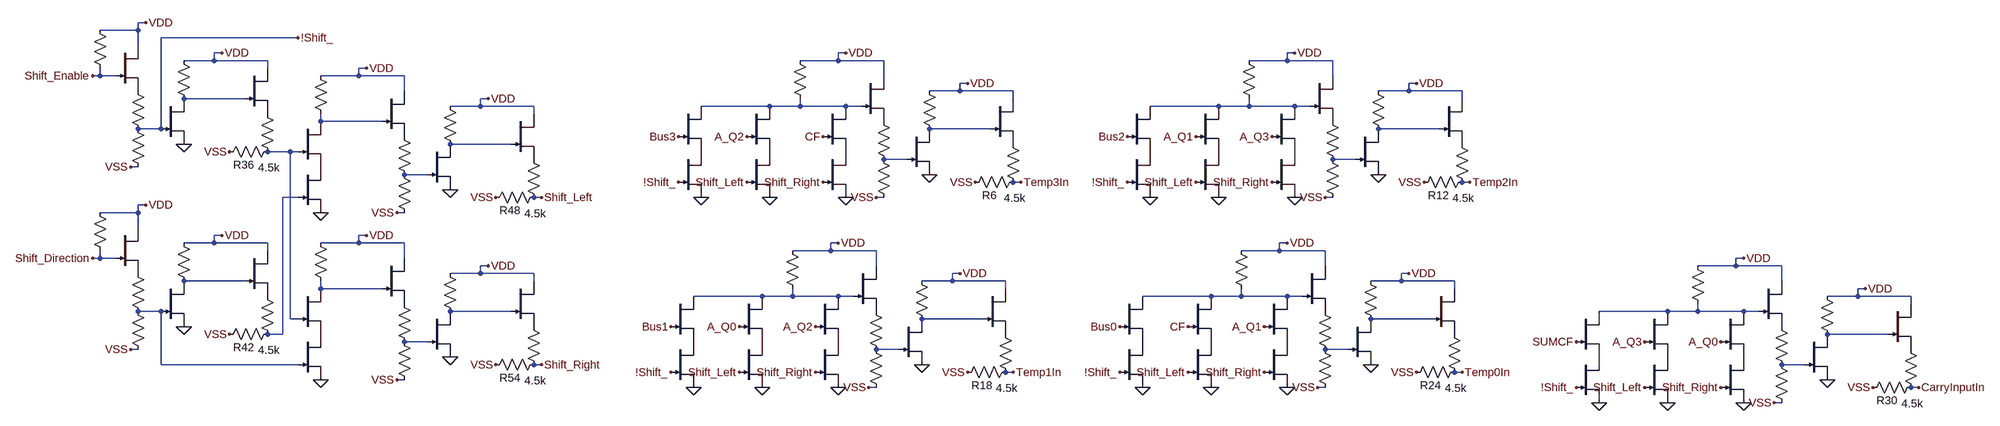
[diagram p0: schematic shift_logic.asc]
shift_logic.asc, the LTspice schematic file:
Version 4.1
SHEET 1 109444 42780
WIRE -5792 3776 -5808 3776
WIRE -5808 3792 -5808 3776
WIRE -5808 3792 -5888 3792
WIRE -5472 3808 -5760 3808
WIRE -5808 3824 -5808 3792
WIRE -5632 3840 -5648 3840
WIRE -4320 3840 -4336 3840
WIRE -3376 3840 -3392 3840
WIRE -5648 3856 -5648 3840
WIRE -5648 3856 -5712 3856
WIRE -5536 3856 -5648 3856
WIRE -4336 3856 -4336 3840
WIRE -4336 3856 -4416 3856
WIRE -4240 3856 -4336 3856
WIRE -3392 3856 -3392 3840
WIRE -3392 3856 -3472 3856
WIRE -3296 3856 -3392 3856
WIRE -5536 3872 -5536 3856
WIRE -5328 3872 -5344 3872
WIRE -5888 3888 -5888 3872
WIRE -5888 3888 -5904 3888
WIRE -5856 3888 -5888 3888
WIRE -5344 3888 -5344 3872
WIRE -5344 3888 -5424 3888
WIRE -5248 3888 -5344 3888
WIRE -4240 3888 -4240 3856
WIRE -3296 3888 -3296 3856
WIRE -4064 3904 -4080 3904
WIRE -3120 3904 -3136 3904
WIRE -5248 3920 -5248 3888
WIRE -4080 3920 -4080 3904
WIRE -4080 3920 -4144 3920
WIRE -3968 3920 -4080 3920
WIRE -3136 3920 -3136 3904
WIRE -3136 3920 -3200 3920
WIRE -3024 3920 -3136 3920
WIRE -5584 3936 -5712 3936
WIRE -5072 3936 -5088 3936
WIRE -3968 3936 -3968 3920
WIRE -3024 3936 -3024 3920
WIRE -5088 3952 -5088 3936
WIRE -5088 3952 -5152 3952
WIRE -4976 3952 -5088 3952
WIRE -4480 3952 -4624 3952
WIRE -4416 3952 -4416 3936
WIRE -4416 3952 -4480 3952
WIRE -4320 3952 -4416 3952
WIRE -4288 3952 -4320 3952
WIRE -3536 3952 -3680 3952
WIRE -3472 3952 -3472 3936
WIRE -3472 3952 -3536 3952
WIRE -3376 3952 -3472 3952
WIRE -3344 3952 -3376 3952
WIRE -4976 3968 -4976 3952
WIRE -5424 3984 -5424 3968
WIRE -5296 3984 -5424 3984
WIRE -5760 4000 -5760 3808
WIRE -5760 4000 -5808 4000
WIRE -4016 4000 -4144 4000
WIRE -3072 4000 -3200 4000
WIRE -5024 4032 -5152 4032
WIRE -5488 4048 -5536 4048
WIRE -5472 4048 -5488 4048
WIRE -4192 4064 -4240 4064
WIRE -3248 4064 -3296 4064
WIRE -5808 4080 -5824 4080
WIRE -5200 4096 -5248 4096
WIRE -3952 4112 -3968 4112
WIRE -3008 4112 -3024 4112
WIRE -5472 4144 -5504 4144
WIRE -4960 4144 -4976 4144
WIRE -4240 4144 -4256 4144
WIRE -3296 4144 -3312 4144
WIRE -5792 4160 -5808 4160
WIRE -5808 4176 -5808 4160
WIRE -5808 4176 -5888 4176
WIRE -5248 4176 -5264 4176
WIRE -5808 4208 -5808 4176
WIRE -5632 4224 -5648 4224
WIRE -5328 4224 -5344 4224
WIRE -5648 4240 -5648 4224
WIRE -5648 4240 -5712 4240
WIRE -5536 4240 -5648 4240
WIRE -5344 4240 -5344 4224
WIRE -5344 4240 -5424 4240
WIRE -5248 4240 -5344 4240
WIRE -4336 4240 -4352 4240
WIRE -3392 4240 -3408 4240
WIRE -5536 4256 -5536 4240
WIRE -4352 4256 -4352 4240
WIRE -4352 4256 -4432 4256
WIRE -4256 4256 -4352 4256
WIRE -3408 4256 -3408 4240
WIRE -3408 4256 -3488 4256
WIRE -3312 4256 -3408 4256
WIRE -5888 4272 -5888 4256
WIRE -5888 4272 -5904 4272
WIRE -5856 4272 -5888 4272
WIRE -5248 4272 -5248 4240
WIRE -2432 4272 -2448 4272
WIRE -5072 4288 -5088 4288
WIRE -4256 4288 -4256 4256
WIRE -3312 4288 -3312 4256
WIRE -2448 4288 -2448 4272
WIRE -2448 4288 -2528 4288
WIRE -2352 4288 -2448 4288
WIRE -5088 4304 -5088 4288
WIRE -5088 4304 -5152 4304
WIRE -4976 4304 -5088 4304
WIRE -4080 4304 -4096 4304
WIRE -3136 4304 -3152 4304
WIRE -5584 4320 -5712 4320
WIRE -4976 4320 -4976 4304
WIRE -4096 4320 -4096 4304
WIRE -4096 4320 -4160 4320
WIRE -3984 4320 -4096 4320
WIRE -3152 4320 -3152 4304
WIRE -3152 4320 -3216 4320
WIRE -3040 4320 -3152 4320
WIRE -2352 4320 -2352 4288
WIRE -5424 4336 -5424 4320
WIRE -5296 4336 -5424 4336
WIRE -3984 4336 -3984 4320
WIRE -3040 4336 -3040 4320
WIRE -2176 4336 -2192 4336
WIRE -4496 4352 -4640 4352
WIRE -4432 4352 -4432 4336
WIRE -4432 4352 -4496 4352
WIRE -4336 4352 -4432 4352
WIRE -4304 4352 -4336 4352
WIRE -3552 4352 -3696 4352
WIRE -3488 4352 -3488 4336
WIRE -3488 4352 -3552 4352
WIRE -3392 4352 -3488 4352
WIRE -3360 4352 -3392 4352
WIRE -2192 4352 -2192 4336
WIRE -2192 4352 -2256 4352
WIRE -2080 4352 -2192 4352
WIRE -2080 4368 -2080 4352
WIRE -5760 4384 -5808 4384
WIRE -5024 4384 -5152 4384
WIRE -2592 4384 -2736 4384
WIRE -2528 4384 -2528 4368
WIRE -2528 4384 -2592 4384
WIRE -2432 4384 -2528 4384
WIRE -2400 4384 -2432 4384
WIRE -5488 4400 -5488 4048
WIRE -5472 4400 -5488 4400
WIRE -4032 4400 -4160 4400
WIRE -3088 4400 -3216 4400
WIRE -5504 4432 -5504 4144
WIRE -5504 4432 -5536 4432
WIRE -2128 4432 -2256 4432
WIRE -5200 4448 -5248 4448
WIRE -5808 4464 -5824 4464
WIRE -4208 4464 -4256 4464
WIRE -3264 4464 -3312 4464
WIRE -5760 4496 -5760 4384
WIRE -5472 4496 -5760 4496
WIRE -4960 4496 -4976 4496
WIRE -2304 4496 -2352 4496
WIRE -3968 4512 -3984 4512
WIRE -3024 4512 -3040 4512
WIRE -5248 4528 -5264 4528
WIRE -4256 4544 -4272 4544
WIRE -3312 4544 -3328 4544
WIRE -2064 4544 -2080 4544
WIRE -2352 4576 -2368 4576
FLAG -4320 4144 0
FLAG -4480 4144 0
FLAG -4144 4096 0
FLAG -4320 3840 VDD
FLAG -4064 3904 VDD
FLAG -4256 4144 VSS
FLAG -4048 4112 VSS
FLAG -4528 4112 Shift_Left
FLAG -4368 4112 Shift_Right
FLAG -4624 4144 0
FLAG -4672 4112 !Shift_
FLAG -4672 4016 Bus3
FLAG -4368 4016 CF
FLAG -3376 4144 0
FLAG -3536 4144 0
FLAG -3200 4096 0
FLAG -3376 3840 VDD
FLAG -3120 3904 VDD
FLAG -3312 4144 VSS
FLAG -3104 4112 VSS
FLAG -3584 4112 Shift_Left
FLAG -3424 4112 Shift_Right
FLAG -3680 4144 0
FLAG -3728 4112 !Shift_
FLAG -3728 4016 Bus2
FLAG -3424 4016 A_Q3
FLAG -3584 4016 A_Q1
FLAG -4528 4016 A_Q2
FLAG -4336 4544 0
FLAG -4496 4544 0
FLAG -4160 4496 0
FLAG -4336 4240 VDD
FLAG -4080 4304 VDD
FLAG -4272 4544 VSS
FLAG -4064 4512 VSS
FLAG -4544 4512 Shift_Left
FLAG -4384 4512 Shift_Right
FLAG -4640 4544 0
FLAG -4688 4512 !Shift_
FLAG -4688 4416 Bus1
FLAG -4384 4416 A_Q2
FLAG -4544 4416 A_Q0
FLAG -3392 4544 0
FLAG -3552 4544 0
FLAG -3216 4496 0
FLAG -3392 4240 VDD
FLAG -3136 4304 VDD
FLAG -3328 4544 VSS
FLAG -3120 4512 VSS
FLAG -3600 4512 Shift_Left
FLAG -3440 4512 Shift_Right
FLAG -3696 4544 0
FLAG -3744 4512 !Shift_
FLAG -3744 4416 Bus0
FLAG -3440 4416 A_Q1
FLAG -3600 4416 CF
FLAG -2432 4576 0
FLAG -2592 4576 0
FLAG -2256 4528 0
FLAG -2432 4272 VDD
FLAG -2176 4336 VDD
FLAG -2368 4576 VSS
FLAG -2160 4544 VSS
FLAG -2640 4544 Shift_Left
FLAG -2480 4544 Shift_Right
FLAG -2736 4576 0
FLAG -2784 4544 !Shift_
FLAG -2480 4448 A_Q0
FLAG -2640 4448 A_Q3
FLAG -3952 4112 Temp3In
FLAG -3008 4112 Temp2In
FLAG -3024 4512 Temp0In
FLAG -3968 4512 Temp1In
FLAG -2064 4544 CarryInputIn
FLAG -5712 4032 0
FLAG -5792 3776 VDD
FLAG -5632 3840 VDD
FLAG -5824 4080 VSS
FLAG -5616 4048 VSS
FLAG -5904 3888 Shift_Enable
FLAG -5712 4416 0
FLAG -5792 4160 VDD
FLAG -5632 4224 VDD
FLAG -5824 4464 VSS
FLAG -5616 4432 VSS
FLAG -5904 4272 Shift_Direction
FLAG -4960 4496 Shift_Right
FLAG -4960 4144 Shift_Left
FLAG -5472 3808 !Shift_
FLAG -5424 4176 0
FLAG -5152 4128 0
FLAG -5328 3872 VDD
FLAG -5072 3936 VDD
FLAG -5264 4176 VSS
FLAG -5056 4144 VSS
FLAG -5424 4528 0
FLAG -5152 4480 0
FLAG -5328 4224 VDD
FLAG -5072 4288 VDD
FLAG -5264 4528 VSS
FLAG -5056 4496 VSS
FLAG -2784 4448 SUMCF
SYMBOL njf -4528 3952 R0
WINDOW 3 198 224 Invisible 2
WINDOW 0 56 32 Invisible 2
SYMATTR Value DR
SYMATTR InstName J_A1
SYMBOL res -4432 3840 R0
WINDOW 0 -35 57 Invisible 2
WINDOW 3 34 56 Invisible 2
SYMATTR InstName R1
SYMATTR Value 100k
SYMBOL njf -4288 3888 R0
WINDOW 0 56 32 Invisible 2
WINDOW 3 56 72 Invisible 2
SYMATTR InstName J_F1
SYMATTR Value DR
SYMBOL res -4256 3968 R0
WINDOW 0 -136 215 Invisible 2
WINDOW 3 34 58 Invisible 2
SYMATTR InstName R2
SYMATTR Value 1k
SYMBOL res -4256 4048 R0
WINDOW 0 -22 62 Invisible 2
WINDOW 3 37 62 Invisible 2
SYMATTR InstName R3
SYMATTR Value 4.8k
SYMBOL njf -4368 3952 R0
WINDOW 0 56 32 Invisible 2
WINDOW 3 56 72 Invisible 2
SYMATTR InstName J_B1
SYMATTR Value DR
SYMBOL njf -4192 4000 R0
WINDOW 0 56 32 Invisible 2
WINDOW 3 56 72 Invisible 2
SYMATTR InstName J_A2
SYMATTR Value DR
SYMBOL res -4160 3904 R0
WINDOW 0 56 32 Invisible 2
WINDOW 3 56 72 Invisible 2
SYMATTR InstName R4
SYMATTR Value 50k
SYMBOL njf -4016 3936 R0
WINDOW 0 56 32 Invisible 2
WINDOW 3 56 72 Invisible 2
SYMATTR InstName J_A3
SYMATTR Value DR
SYMBOL res -3984 4016 R0
WINDOW 0 37 24 Invisible 2
WINDOW 3 -30 25 Invisible 2
SYMATTR InstName R5
SYMATTR Value 1k
SYMBOL res -3952 4096 R90
WINDOW 0 59 66 VBottom 2
WINDOW 3 34 13 VTop 2
SYMATTR InstName R6
SYMATTR Value 4.5k
SYMBOL njf -4528 4048 R0
WINDOW 0 119 134 Invisible 2
WINDOW 3 131 136 Invisible 2
SYMATTR InstName J_A4
SYMATTR Value DR
SYMBOL njf -4368 4048 R0
WINDOW 3 -27 143 Invisible 2
WINDOW 0 56 32 Invisible 2
SYMATTR Value DR
SYMATTR InstName J_B2
SYMBOL njf -4672 3952 R0
WINDOW 0 63 15 Invisible 2
WINDOW 3 62 106 Invisible 2
SYMATTR InstName J_A5
SYMATTR Value DR
SYMBOL njf -4672 4048 R0
WINDOW 0 254 138 Invisible 2
WINDOW 3 277 142 Invisible 2
SYMATTR InstName J_A6
SYMATTR Value DR
SYMBOL njf -3584 3952 R0
WINDOW 3 198 224 Invisible 2
WINDOW 0 56 32 Invisible 2
SYMATTR Value DR
SYMATTR InstName J_A7
SYMBOL res -3488 3840 R0
WINDOW 0 -35 57 Invisible 2
WINDOW 3 34 56 Invisible 2
SYMATTR InstName R7
SYMATTR Value 100k
SYMBOL njf -3344 3888 R0
WINDOW 0 56 32 Invisible 2
WINDOW 3 56 72 Invisible 2
SYMATTR InstName J_F2
SYMATTR Value DR
SYMBOL res -3312 3968 R0
WINDOW 0 -136 215 Invisible 2
WINDOW 3 34 58 Invisible 2
SYMATTR InstName R8
SYMATTR Value 1k
SYMBOL res -3312 4048 R0
WINDOW 0 -22 62 Invisible 2
WINDOW 3 37 62 Invisible 2
SYMATTR InstName R9
SYMATTR Value 4.8k
SYMBOL njf -3424 3952 R0
WINDOW 0 56 32 Invisible 2
WINDOW 3 56 72 Invisible 2
SYMATTR InstName J_B3
SYMATTR Value DR
SYMBOL njf -3248 4000 R0
WINDOW 0 56 32 Invisible 2
WINDOW 3 56 72 Invisible 2
SYMATTR InstName J_A8
SYMATTR Value DR
SYMBOL res -3216 3904 R0
WINDOW 0 56 32 Invisible 2
WINDOW 3 56 72 Invisible 2
SYMATTR InstName R10
SYMATTR Value 50k
SYMBOL njf -3072 3936 R0
WINDOW 0 56 32 Invisible 2
WINDOW 3 56 72 Invisible 2
SYMATTR InstName J_A9
SYMATTR Value DR
SYMBOL res -3040 4016 R0
WINDOW 0 37 24 Invisible 2
WINDOW 3 -30 25 Invisible 2
SYMATTR InstName R11
SYMATTR Value 1k
SYMBOL res -3008 4096 R90
WINDOW 0 59 66 VBottom 2
WINDOW 3 34 13 VTop 2
SYMATTR InstName R12
SYMATTR Value 4.5k
SYMBOL njf -3584 4048 R0
WINDOW 0 119 134 Invisible 2
WINDOW 3 131 136 Invisible 2
SYMATTR InstName J_A10
SYMATTR Value DR
SYMBOL njf -3424 4048 R0
WINDOW 3 -27 143 Invisible 2
WINDOW 0 56 32 Invisible 2
SYMATTR Value DR
SYMATTR InstName J_B4
SYMBOL njf -3728 3952 R0
WINDOW 0 63 15 Invisible 2
WINDOW 3 62 106 Invisible 2
SYMATTR InstName J_A11
SYMATTR Value DR
SYMBOL njf -3728 4048 R0
WINDOW 0 254 138 Invisible 2
WINDOW 3 277 142 Invisible 2
SYMATTR InstName J_A12
SYMATTR Value DR
SYMBOL njf -4544 4352 R0
WINDOW 3 198 224 Invisible 2
WINDOW 0 56 32 Invisible 2
SYMATTR Value DR
SYMATTR InstName J_A13
SYMBOL res -4448 4240 R0
WINDOW 0 -35 57 Invisible 2
WINDOW 3 34 56 Invisible 2
SYMATTR InstName R13
SYMATTR Value 100k
SYMBOL njf -4304 4288 R0
WINDOW 0 56 32 Invisible 2
WINDOW 3 56 72 Invisible 2
SYMATTR InstName J_F3
SYMATTR Value DR
SYMBOL res -4272 4368 R0
WINDOW 0 -136 215 Invisible 2
WINDOW 3 34 58 Invisible 2
SYMATTR InstName R14
SYMATTR Value 1k
SYMBOL res -4272 4448 R0
WINDOW 0 -10 158 Invisible 2
WINDOW 3 37 62 Invisible 2
SYMATTR InstName R15
SYMATTR Value 4.8k
SYMBOL njf -4384 4352 R0
WINDOW 0 56 32 Invisible 2
WINDOW 3 56 72 Invisible 2
SYMATTR InstName J_B5
SYMATTR Value DR
SYMBOL njf -4208 4400 R0
WINDOW 0 56 32 Invisible 2
WINDOW 3 56 72 Invisible 2
SYMATTR InstName J_A14
SYMATTR Value DR
SYMBOL res -4176 4304 R0
WINDOW 0 56 32 Invisible 2
WINDOW 3 56 72 Invisible 2
SYMATTR InstName R16
SYMATTR Value 50k
SYMBOL njf -4032 4336 R0
WINDOW 0 56 32 Invisible 2
WINDOW 3 56 72 Invisible 2
SYMATTR InstName J_A15
SYMATTR Value DR
SYMBOL res -4000 4416 R0
WINDOW 0 37 24 Invisible 2
WINDOW 3 -30 25 Invisible 2
SYMATTR InstName R17
SYMATTR Value 1k
SYMBOL res -3968 4496 R90
WINDOW 0 59 66 VBottom 2
WINDOW 3 34 13 VTop 2
SYMATTR InstName R18
SYMATTR Value 4.5k
SYMBOL njf -4544 4448 R0
WINDOW 0 119 134 Invisible 2
WINDOW 3 131 136 Invisible 2
SYMATTR InstName J_A16
SYMATTR Value DR
SYMBOL njf -4384 4448 R0
WINDOW 3 -27 143 Invisible 2
WINDOW 0 56 32 Invisible 2
SYMATTR Value DR
SYMATTR InstName J_B6
SYMBOL njf -4688 4352 R0
WINDOW 0 63 15 Invisible 2
WINDOW 3 62 106 Invisible 2
SYMATTR InstName J_A17
SYMATTR Value DR
SYMBOL njf -4688 4448 R0
WINDOW 0 254 138 Invisible 2
WINDOW 3 277 142 Invisible 2
SYMATTR InstName J_A18
SYMATTR Value DR
SYMBOL njf -3600 4352 R0
WINDOW 3 198 224 Invisible 2
WINDOW 0 56 32 Invisible 2
SYMATTR Value DR
SYMATTR InstName J_A19
SYMBOL res -3504 4240 R0
WINDOW 0 -35 57 Invisible 2
WINDOW 3 34 56 Invisible 2
SYMATTR InstName R19
SYMATTR Value 100k
SYMBOL njf -3360 4288 R0
WINDOW 0 56 32 Invisible 2
WINDOW 3 56 72 Invisible 2
SYMATTR InstName J_F4
SYMATTR Value DR
SYMBOL res -3328 4368 R0
WINDOW 0 -136 215 Invisible 2
WINDOW 3 34 58 Invisible 2
SYMATTR InstName R20
SYMATTR Value 1k
SYMBOL res -3328 4448 R0
WINDOW 0 -10 158 Invisible 2
WINDOW 3 37 62 Invisible 2
SYMATTR InstName R21
SYMATTR Value 4.8k
SYMBOL njf -3440 4352 R0
WINDOW 0 56 32 Invisible 2
WINDOW 3 56 72 Invisible 2
SYMATTR InstName J_B7
SYMATTR Value DR
SYMBOL njf -3264 4400 R0
WINDOW 0 56 32 Invisible 2
WINDOW 3 56 72 Invisible 2
SYMATTR InstName J_A20
SYMATTR Value DR
SYMBOL res -3232 4304 R0
WINDOW 0 56 32 Invisible 2
WINDOW 3 56 72 Invisible 2
SYMATTR InstName R22
SYMATTR Value 50k
SYMBOL njf -3088 4336 R0
WINDOW 0 56 32 Invisible 2
WINDOW 3 56 72 Invisible 2
SYMATTR InstName J_A21
SYMATTR Value DR
SYMBOL res -3056 4416 R0
WINDOW 0 37 24 Invisible 2
WINDOW 3 -30 25 Invisible 2
SYMATTR InstName R23
SYMATTR Value 1k
SYMBOL res -3024 4496 R90
WINDOW 0 59 66 VBottom 2
WINDOW 3 34 13 VTop 2
SYMATTR InstName R24
SYMATTR Value 4.5k
SYMBOL njf -3600 4448 R0
WINDOW 0 119 134 Invisible 2
WINDOW 3 131 136 Invisible 2
SYMATTR InstName J_A22
SYMATTR Value DR
SYMBOL njf -3440 4448 R0
WINDOW 3 -27 143 Invisible 2
WINDOW 0 56 32 Invisible 2
SYMATTR Value DR
SYMATTR InstName J_B8
SYMBOL njf -3744 4352 R0
WINDOW 0 63 15 Invisible 2
WINDOW 3 62 106 Invisible 2
SYMATTR InstName J_A23
SYMATTR Value DR
SYMBOL njf -3744 4448 R0
WINDOW 0 254 138 Invisible 2
WINDOW 3 277 142 Invisible 2
SYMATTR InstName J_A24
SYMATTR Value DR
SYMBOL njf -2640 4384 R0
WINDOW 3 198 224 Invisible 2
WINDOW 0 56 32 Invisible 2
SYMATTR Value DR
SYMATTR InstName J_A25
SYMBOL res -2544 4272 R0
WINDOW 0 -35 57 Invisible 2
WINDOW 3 34 56 Invisible 2
SYMATTR InstName R25
SYMATTR Value 100k
SYMBOL njf -2400 4320 R0
WINDOW 0 56 32 Invisible 2
WINDOW 3 56 72 Invisible 2
SYMATTR InstName J_F5
SYMATTR Value DR
SYMBOL res -2368 4400 R0
WINDOW 0 -136 215 Invisible 2
WINDOW 3 34 58 Invisible 2
SYMATTR InstName R26
SYMATTR Value 1k
SYMBOL res -2368 4480 R0
WINDOW 0 -10 158 Invisible 2
WINDOW 3 37 62 Invisible 2
SYMATTR InstName R27
SYMATTR Value 4.8k
SYMBOL njf -2480 4384 R0
WINDOW 0 56 32 Invisible 2
WINDOW 3 56 72 Invisible 2
SYMATTR InstName J_B9
SYMATTR Value DR
SYMBOL njf -2304 4432 R0
WINDOW 0 56 32 Invisible 2
WINDOW 3 56 72 Invisible 2
SYMATTR InstName J_A26
SYMATTR Value DR
SYMBOL res -2272 4336 R0
WINDOW 0 56 32 Invisible 2
WINDOW 3 56 72 Invisible 2
SYMATTR InstName R28
SYMATTR Value 50k
SYMBOL njf -2128 4368 R0
WINDOW 0 56 32 Invisible 2
WINDOW 3 56 72 Invisible 2
SYMATTR InstName J_A27
SYMATTR Value DR
SYMBOL res -2096 4448 R0
WINDOW 0 37 24 Invisible 2
WINDOW 3 -30 25 Invisible 2
SYMATTR InstName R29
SYMATTR Value 1k
SYMBOL res -2064 4528 R90
WINDOW 0 59 66 VBottom 2
WINDOW 3 34 13 VTop 2
SYMATTR InstName R30
SYMATTR Value 4.5k
SYMBOL njf -2640 4480 R0
WINDOW 0 119 134 Invisible 2
WINDOW 3 131 136 Invisible 2
SYMATTR InstName J_A28
SYMATTR Value DR
SYMBOL njf -2480 4480 R0
WINDOW 3 -27 143 Invisible 2
WINDOW 0 56 32 Invisible 2
SYMATTR Value DR
SYMATTR InstName J_B10
SYMBOL njf -2784 4384 R0
WINDOW 0 63 15 Invisible 2
WINDOW 3 62 106 Invisible 2
SYMATTR InstName J_A29
SYMATTR Value DR
SYMBOL njf -2784 4480 R0
WINDOW 0 254 138 Invisible 2
WINDOW 3 277 142 Invisible 2
SYMATTR InstName J_A30
SYMATTR Value DR
SYMBOL res -5904 3776 R0
WINDOW 0 -35 57 Invisible 2
WINDOW 3 34 56 Invisible 2
SYMATTR InstName R31
SYMATTR Value 100k
SYMBOL njf -5856 3824 R0
WINDOW 0 56 32 Invisible 2
WINDOW 3 56 72 Invisible 2
SYMATTR InstName J_F6
SYMATTR Value DR
SYMBOL res -5824 3904 R0
WINDOW 0 -24 60 Invisible 2
WINDOW 3 34 58 Invisible 2
SYMATTR InstName R32
SYMATTR Value 1k
SYMBOL res -5824 3984 R0
WINDOW 0 -22 62 Invisible 2
WINDOW 3 37 62 Invisible 2
SYMATTR InstName R33
SYMATTR Value 4.8k
SYMBOL njf -5760 3936 R0
WINDOW 0 56 32 Invisible 2
WINDOW 3 56 72 Invisible 2
SYMATTR InstName J_A31
SYMATTR Value DR
SYMBOL res -5728 3840 R0
WINDOW 0 56 32 Invisible 2
WINDOW 3 56 72 Invisible 2
SYMATTR InstName R34
SYMATTR Value 50k
SYMBOL njf -5584 3872 R0
WINDOW 0 56 32 Invisible 2
WINDOW 3 56 72 Invisible 2
SYMATTR InstName J_A32
SYMATTR Value DR
SYMBOL res -5552 3952 R0
WINDOW 0 37 24 Invisible 2
WINDOW 3 -30 25 Invisible 2
SYMATTR InstName R35
SYMATTR Value 1k
SYMBOL res -5520 4032 R90
WINDOW 0 59 66 VBottom 2
WINDOW 3 34 13 VTop 2
SYMATTR InstName R36
SYMATTR Value 4.5k
SYMBOL res -5904 4160 R0
WINDOW 0 -35 57 Invisible 2
WINDOW 3 34 56 Invisible 2
SYMATTR InstName R37
SYMATTR Value 100k
SYMBOL njf -5856 4208 R0
WINDOW 0 56 32 Invisible 2
WINDOW 3 56 72 Invisible 2
SYMATTR InstName J_F7
SYMATTR Value DR
SYMBOL res -5824 4288 R0
WINDOW 0 -24 60 Invisible 2
WINDOW 3 34 58 Invisible 2
SYMATTR InstName R38
SYMATTR Value 1k
SYMBOL res -5824 4368 R0
WINDOW 0 -22 62 Invisible 2
WINDOW 3 37 62 Invisible 2
SYMATTR InstName R39
SYMATTR Value 4.8k
SYMBOL njf -5760 4320 R0
WINDOW 0 56 32 Invisible 2
WINDOW 3 56 72 Invisible 2
SYMATTR InstName J_A33
SYMATTR Value DR
SYMBOL res -5728 4224 R0
WINDOW 0 56 32 Invisible 2
WINDOW 3 56 72 Invisible 2
SYMATTR InstName R40
SYMATTR Value 50k
SYMBOL njf -5584 4256 R0
WINDOW 0 56 32 Invisible 2
WINDOW 3 56 72 Invisible 2
SYMATTR InstName J_A34
SYMATTR Value DR
SYMBOL res -5552 4336 R0
WINDOW 0 37 24 Invisible 2
WINDOW 3 -30 25 Invisible 2
SYMATTR InstName R41
SYMATTR Value 1k
SYMBOL res -5520 4416 R90
WINDOW 0 59 66 VBottom 2
WINDOW 3 34 13 VTop 2
SYMATTR InstName R42
SYMATTR Value 4.5k
SYMBOL res -5440 3872 R0
WINDOW 0 79 204 Invisible 2
WINDOW 3 83 172 Invisible 2
SYMATTR InstName R43
SYMATTR Value 100k
SYMBOL njf -5296 3920 R0
WINDOW 0 56 32 Invisible 2
WINDOW 3 56 72 Invisible 2
SYMATTR InstName J_F8
SYMATTR Value DR
SYMBOL res -5264 4000 R0
WINDOW 0 -136 215 Invisible 2
WINDOW 3 34 58 Invisible 2
SYMATTR InstName R44
SYMATTR Value 1k
SYMBOL res -5264 4080 R0
WINDOW 0 -68 47 Invisible 2
WINDOW 3 37 62 Invisible 2
SYMATTR InstName R45
SYMATTR Value 4.8k
SYMBOL njf -5472 3984 R0
WINDOW 0 56 32 Invisible 2
WINDOW 3 56 72 Invisible 2
SYMATTR InstName J_B11
SYMATTR Value DR
SYMBOL njf -5200 4032 R0
WINDOW 0 56 32 Invisible 2
WINDOW 3 56 72 Invisible 2
SYMATTR InstName J_A35
SYMATTR Value DR
SYMBOL res -5168 3936 R0
WINDOW 0 56 32 Invisible 2
WINDOW 3 56 72 Invisible 2
SYMATTR InstName R46
SYMATTR Value 50k
SYMBOL njf -5024 3968 R0
WINDOW 0 56 32 Invisible 2
WINDOW 3 56 72 Invisible 2
SYMATTR InstName J_A36
SYMATTR Value DR
SYMBOL res -4992 4048 R0
WINDOW 0 37 24 Invisible 2
WINDOW 3 -30 25 Invisible 2
SYMATTR InstName R47
SYMATTR Value 1k
SYMBOL res -4960 4128 R90
WINDOW 0 59 66 VBottom 2
WINDOW 3 34 13 VTop 2
SYMATTR InstName R48
SYMATTR Value 4.5k
SYMBOL njf -5472 4080 R0
WINDOW 3 110 95 Invisible 2
WINDOW 0 56 32 Invisible 2
SYMATTR Value DR
SYMATTR InstName J_B12
SYMBOL res -5440 4224 R0
WINDOW 0 79 204 Invisible 2
WINDOW 3 83 172 Invisible 2
SYMATTR InstName R49
SYMATTR Value 100k
SYMBOL njf -5296 4272 R0
WINDOW 0 56 32 Invisible 2
WINDOW 3 56 72 Invisible 2
SYMATTR InstName J_F9
SYMATTR Value DR
SYMBOL res -5264 4352 R0
WINDOW 0 -136 215 Invisible 2
WINDOW 3 34 58 Invisible 2
SYMATTR InstName R50
SYMATTR Value 1k
SYMBOL res -5264 4432 R0
WINDOW 0 -68 47 Invisible 2
WINDOW 3 37 62 Invisible 2
SYMATTR InstName R51
SYMATTR Value 4.8k
SYMBOL njf -5472 4336 R0
WINDOW 0 56 32 Invisible 2
WINDOW 3 56 72 Invisible 2
SYMATTR InstName J_B13
SYMATTR Value DR
SYMBOL njf -5200 4384 R0
WINDOW 0 56 32 Invisible 2
WINDOW 3 56 72 Invisible 2
SYMATTR InstName J_A37
SYMATTR Value DR
SYMBOL res -5168 4288 R0
WINDOW 0 56 32 Invisible 2
WINDOW 3 56 72 Invisible 2
SYMATTR InstName R52
SYMATTR Value 50k
SYMBOL njf -5024 4320 R0
WINDOW 0 56 32 Invisible 2
WINDOW 3 56 72 Invisible 2
SYMATTR InstName J_A38
SYMATTR Value DR
SYMBOL res -4992 4400 R0
WINDOW 0 37 24 Invisible 2
WINDOW 3 -30 25 Invisible 2
SYMATTR InstName R53
SYMATTR Value 1k
SYMBOL res -4960 4480 R90
WINDOW 0 59 66 VBottom 2
WINDOW 3 34 13 VTop 2
SYMATTR InstName R54
SYMATTR Value 4.5k
SYMBOL njf -5472 4432 R0
WINDOW 3 110 95 Invisible 2
WINDOW 0 56 32 Invisible 2
SYMATTR Value DR
SYMATTR InstName J_B14

The netlist it stands for:
* shift_logic.asc
J_A1 N002 A_Q2 P001 DR
R1 VDD N002 100k
J_F1 VDD N002 P002 DR
R2 P002 N009 1k
R3 N009 VSS 4.8k
J_B1 N002 CF P003 DR
J_A2 N005 N009 0 DR
R4 VDD N005 50k
J_A3 VDD N005 P004 DR
R5 P004 Temp3In 1k
R6 Temp3In VSS 4.5k
J_A4 P001 Shift_Left 0 DR
J_B2 P003 Shift_Right 0 DR
J_A5 N002 Bus3 P005 DR
J_A6 P005 !Shift_ 0 DR
J_A7 N003 A_Q1 P006 DR
R7 VDD N003 100k
J_F2 VDD N003 P007 DR
R8 P007 N010 1k
R9 N010 VSS 4.8k
J_B3 N003 A_Q3 P008 DR
J_A8 N006 N010 0 DR
R10 VDD N006 50k
J_A9 VDD N006 P009 DR
R11 P009 Temp2In 1k
R12 Temp2In VSS 4.5k
J_A10 P006 Shift_Left 0 DR
J_B4 P008 Shift_Right 0 DR
J_A11 N003 Bus2 P010 DR
J_A12 P010 !Shift_ 0 DR
J_A13 N015 A_Q0 P011 DR
R13 VDD N015 100k
J_F3 VDD N015 P012 DR
R14 P012 N024 1k
R15 N024 VSS 4.8k
J_B5 N015 A_Q2 P013 DR
J_A14 N020 N024 0 DR
R16 VDD N020 50k
J_A15 VDD N020 P014 DR
R17 P014 Temp1In 1k
R18 Temp1In VSS 4.5k
J_A16 P011 Shift_Left 0 DR
J_B6 P013 Shift_Right 0 DR
J_A17 N015 Bus1 P015 DR
J_A18 P015 !Shift_ 0 DR
J_A19 N016 CF P016 DR
R19 VDD N016 100k
J_F4 VDD N016 P017 DR
R20 P017 N025 1k
R21 N025 VSS 4.8k
J_B7 N016 A_Q1 P018 DR
J_A20 N021 N025 0 DR
R22 VDD N021 50k
J_A21 VDD N021 P019 DR
R23 P019 Temp0In 1k
R24 Temp0In VSS 4.5k
J_A22 P016 Shift_Left 0 DR
J_B8 P018 Shift_Right 0 DR
J_A23 N016 Bus0 P020 DR
J_A24 P020 !Shift_ 0 DR
J_A25 N019 A_Q3 P021 DR
R25 VDD N019 100k
J_F5 VDD N019 P022 DR
R26 P022 N026 1k
R27 N026 VSS 4.8k
J_B9 N019 A_Q0 P023 DR
J_A26 N022 N026 0 DR
R28 VDD N022 50k
J_A27 VDD N022 P024 DR
R29 P024 CarryInputIn 1k
R30 CarryInputIn VSS 4.5k
J_A28 P021 Shift_Left 0 DR
J_B10 P023 Shift_Right 0 DR
J_A29 N019 SUMCF P025 DR
J_A30 P025 !Shift_ 0 DR
R31 VDD Shift_Enable 100k
J_F6 VDD Shift_Enable P026 DR
R32 P026 !Shift_ 1k
R33 !Shift_ VSS 4.8k
J_A31 N001 !Shift_ 0 DR
R34 VDD N001 50k
J_A32 VDD N001 P027 DR
R35 P027 N008 1k
R36 N008 VSS 4.5k
R37 VDD Shift_Direction 100k
J_F7 VDD Shift_Direction P028 DR
R38 P028 N017 1k
R39 N017 VSS 4.8k
J_A33 N013 N017 0 DR
R40 VDD N013 50k
J_A34 VDD N013 P029 DR
R41 P029 N012 1k
R42 N012 VSS 4.5k
R43 VDD N004 100k
J_F8 VDD N004 P030 DR
R44 P030 N011 1k
R45 N011 VSS 4.8k
J_B11 N004 N008 P031 DR
J_A35 N007 N011 0 DR
R46 VDD N007 50k
J_A36 VDD N007 P032 DR
R47 P032 Shift_Left 1k
R48 Shift_Left VSS 4.5k
J_B12 P031 N012 0 DR
R49 VDD N014 100k
J_F9 VDD N014 P033 DR
R50 P033 N023 1k
R51 N023 VSS 4.8k
J_B13 N014 N008 P034 DR
J_A37 N018 N023 0 DR
R52 VDD N018 50k
J_A38 VDD N018 P035 DR
R53 P035 Shift_Right 1k
R54 Shift_Right VSS 4.5k
J_B14 P034 N017 0 DR
.model NJF NJF
.model PJF PJF
.lib standard.jft
.backanno
.end